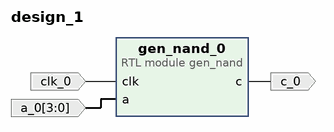
[diagram p0: block diagram of the top level]
# Vivado block design design_1, xc7a100tcsg324-3, Vivado 2018.2
create_bd_design design_1

create_bd_port -dir I -type clk clk_0
create_bd_port -dir O c_0
create_bd_port -dir I -from 3 -to 0 a_0

create_bd_cell -type module -reference gen_nand gen_nand_0

# ---- connections ----

connect_bd_net -net clk_0_1 [get_bd_ports clk_0] [get_bd_pins gen_nand_0/clk]
connect_bd_net [get_bd_pins gen_nand_0/c] [get_bd_ports c_0]
connect_bd_net -net a_0_1 [get_bd_ports a_0] [get_bd_pins gen_nand_0/a]

validate_bd_design
save_bd_design
